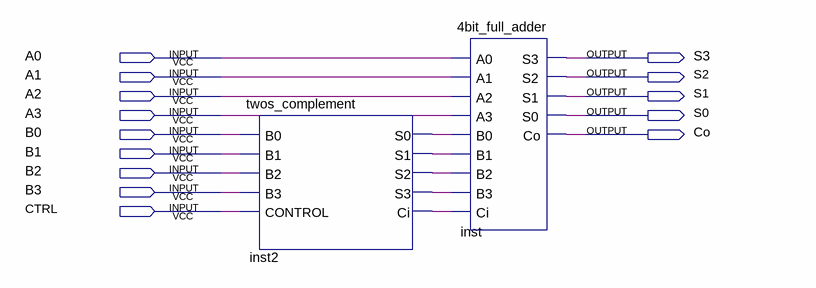
[diagram p0: schematic sheet]
// Quartus schematic 4bit_full_adder_subtractor.bdf as structural Verilog: 2 symbols, 14 pins
module \4bit_full_adder_subtractor  (
  input  A0,
  input  A1,
  input  A2,
  input  A3,
  input  B0,
  input  B1,
  input  B2,
  input  B3,
  input  CTRL,
  output S3,
  output S2,
  output S1,
  output S0,
  output Co
);

  wire inst2_ci, inst2_s0, inst2_s1, inst2_s2, inst2_s3;

  twos_complement inst2 (
    .B0(B0), .B1(B1), .B2(B2), .B3(B3), .CONTROL(CTRL), .S0(inst2_s0), .S1(inst2_s1), .S2(inst2_s2),
    .S3(inst2_s3), .Ci(inst2_ci));
  \4bit_full_adder  inst (
    .A0(A0), .A1(A1), .A2(A2), .A3(A3), .B0(inst2_s0), .B1(inst2_s1), .B2(inst2_s2), .B3(inst2_s3),
    .Ci(inst2_ci), .S3(S3), .S2(S2), .S1(S1), .S0(S0), .Co(Co));
endmodule
